# Altium project Seminar_SuperBC.PrjPcb
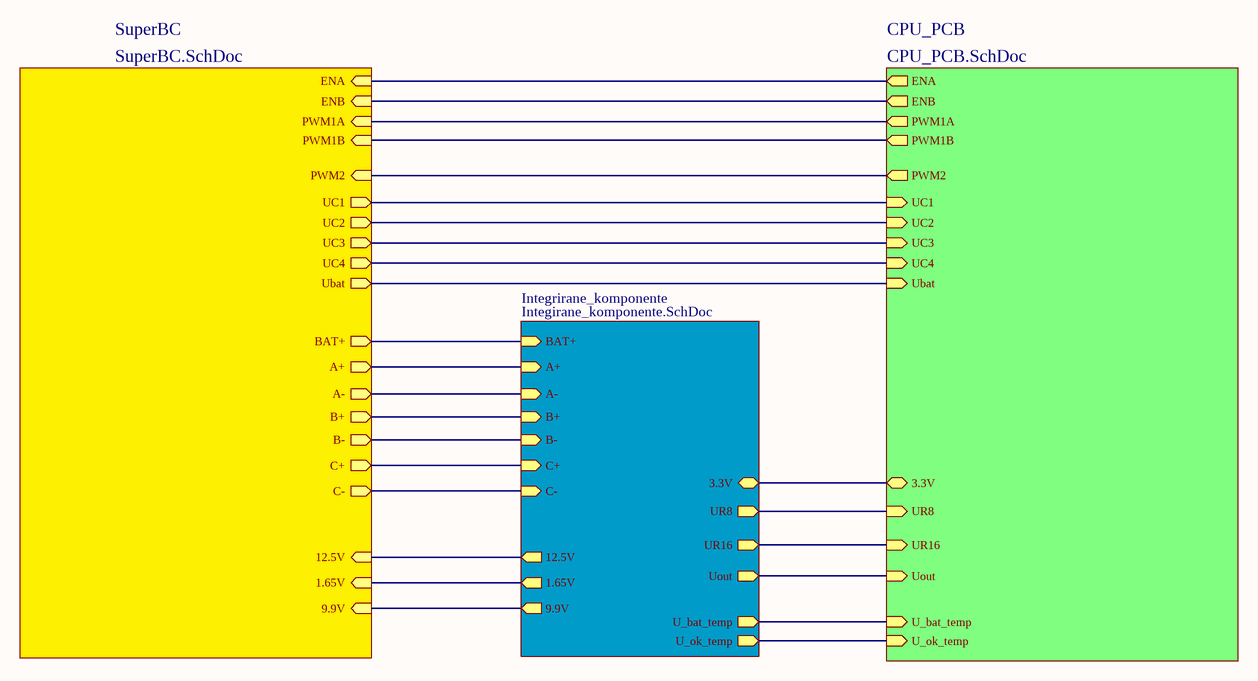
[diagram p0: Main.SchDoc]
4 sheets, 197 parts. Net scope: hierarchical (ports join the sheet entries above them; power ports are global).
Board file: PCB.PcbDoc
Sheets:
  Main.SchDoc
    CPU_PCB = CPU_PCB.SchDoc
    SuperBC = SuperBC.SchDoc
    Integrirane_komponente = Integirane_komponente.SchDoc

## Sheet Main.SchDoc
size A4; Address1: Unska 3; Address2: 10000; Address3: Zagreb; SheetNumber: 1; DocumentName: Main; ProjectName: Main

### Sub-sheets
CPU_PCB = CPU_PCB.SchDoc: PWM1A (out), PWM2 (out), UC1 (in), UC2 (in), UC3 (in), UC4 (in), Ubat (in), UR8 (in), UR16 (in), Uout (in), 3.3V, U_bat_temp (in), U_ok_temp (in), PWM1B (out), ENA (out), ENB (out)
Integrirane_komponente = Integirane_komponente.SchDoc: BAT+ (in), A+ (in), A- (in), B+ (in), B- (in), C+ (in), C- (in), 12.5V (out), 1.65V (out), 9.9V (out), UR8 (out), UR16 (out), Uout (out), 3.3V, U_bat_temp (out), U_ok_temp (out)
SuperBC = SuperBC.SchDoc: PWM1A (in), PWM2 (in), UC1 (out), UC2 (out), UC3 (out), UC4 (out), Ubat (out), BAT+ (out), A+ (out), A- (out), B+ (out), B- (out), C+ (out), C- (out), 12.5V (in), 1.65V (in), 9.9V (in), PWM1B (in), ENB (in), ENA (in)

### Nets
1.65V: sheet SuperBC/1.65V, sheet Integrirane_komponente/1.65V
3.3V: sheet CPU_PCB/3.3V, sheet Integrirane_komponente/3.3V
9.9V: sheet SuperBC/9.9V, sheet Integrirane_komponente/9.9V
12.5V: sheet SuperBC/12.5V, sheet Integrirane_komponente/12.5V
A-: sheet SuperBC/A-, sheet Integrirane_komponente/A-
B-: sheet SuperBC/B-, sheet SuperBC/C+, sheet Integrirane_komponente/B-, sheet Integrirane_komponente/C+
BAT+: sheet SuperBC/BAT+, sheet Integrirane_komponente/BAT+
UC4: sheet CPU_PCB/UC4, sheet SuperBC/UC4
A+: sheet SuperBC/A+, sheet Integrirane_komponente/A+
B+: sheet SuperBC/B+, sheet Integrirane_komponente/B+
C-: sheet SuperBC/C-, sheet Integrirane_komponente/C-
ENA: sheet CPU_PCB/ENA, sheet SuperBC/ENA
ENB: sheet CPU_PCB/ENB, sheet SuperBC/ENB
PWM1A: sheet CPU_PCB/PWM1A, sheet SuperBC/PWM1A
PWM1B: sheet CPU_PCB/PWM1B, sheet SuperBC/PWM1B
PWM2: sheet CPU_PCB/PWM2, sheet SuperBC/PWM2
U_bat_temp: sheet CPU_PCB/U_bat_temp, sheet Integrirane_komponente/U_bat_temp
U_ok_temp: sheet CPU_PCB/U_ok_temp, sheet Integrirane_komponente/U_ok_temp
Ubat: sheet CPU_PCB/Ubat, sheet SuperBC/Ubat
UC1: sheet CPU_PCB/UC1, sheet SuperBC/UC1
UC2: sheet CPU_PCB/UC2, sheet SuperBC/UC2
UC3: sheet CPU_PCB/UC3, sheet SuperBC/UC3
Uout: sheet CPU_PCB/Uout, sheet Integrirane_komponente/Uout
UR8: sheet CPU_PCB/UR8, sheet Integrirane_komponente/UR8
UR16: sheet CPU_PCB/UR16, sheet Integrirane_komponente/UR16

## Sheet CPU_PCB.SchDoc: CPU
size A4; Organization: FER; Address1: Unska 3; Address2: 10000 Zagreb; Address3: Croatia; SheetNumber: 3; SheetTotal: 4
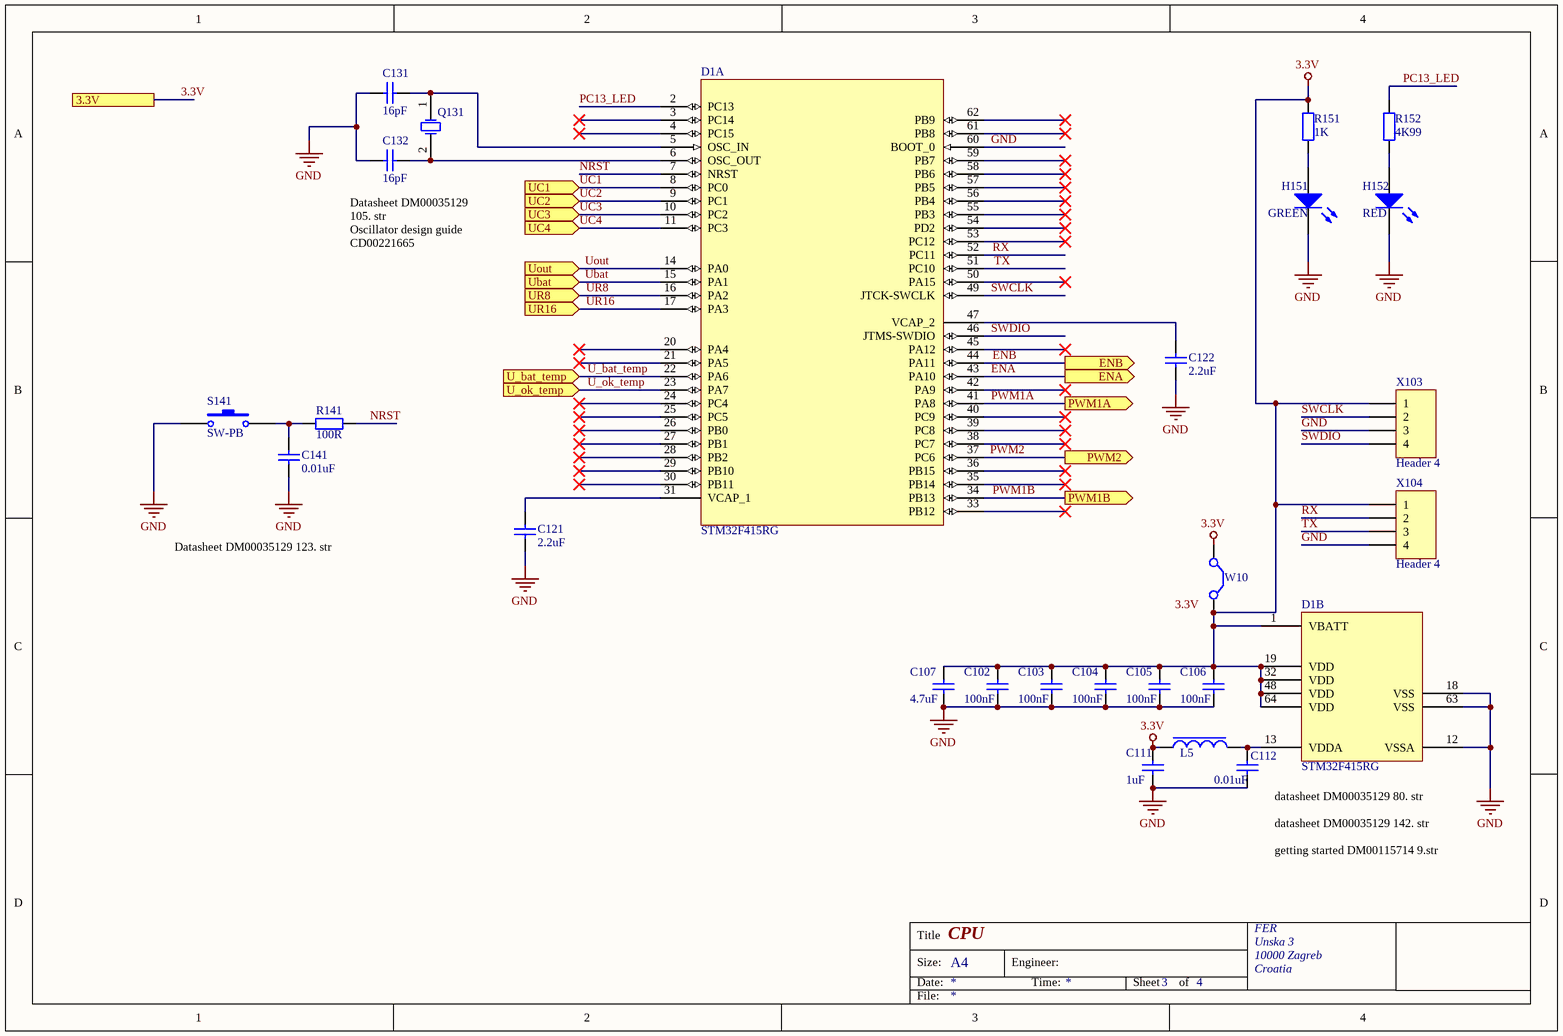
[diagram p1: CPU_PCB.SchDoc]

### Parts
C102  100nF  [CAP_0805]
C103  100nF  [CAP_0805]
C104  100nF  [CAP_0805]
C105  100nF  [CAP_0805]
C106  100nF  [CAP_0805]
C107  4.7uF  [CAP_0805]
C111  1uF  [CAP_0805]
C112  0.01uF  [CAP_0603]
C121  2.2uF  [CAP_0805]
C122  2.2uF  [CAP_0805]
C131  16pF  [CAP_0603]
C132  16pF  [CAP_0603]
C141  0.01uF  [CAP_0603]
D1  STM32F415RG  [LQFP64]  (parts A,B of 2)
H151  GREEN  [LED 1.25X2 SMD]
H152  RED  [LED 1.25X2 SMD]
L5  Inductor  [C0805]  (value not drawn)
Q131  XTAL  [QUARTZ_SMD_16MHZ]  (value not drawn)
R141  100R  [RES_0805]
R151  1K  [RES_0603]
R152  4K99  [RES_0805]
S141  SW-PB  [SWITCH KSEK43GLFS]
W10  Jumper  [HDR1X2]  (value not drawn)
X103  Header 4  [HEADER-4_PIN]
X104  Header 4  [HEADER-4_PIN]

### Ports
3.3V, ENA (out), ENB (out), PWM1A (out), PWM1B (out), PWM2 (out), U_bat_temp (in), U_ok_temp (in), Ubat (in), UC1 (in), UC2 (in), UC3 (in), UC4 (in), Uout (in), UR8 (in), UR16 (in)

### Nets
3.3V: C102.2 C103.2 C104.2 C105.2 C106.2 C107.2 C111.2 D1.1(VBATT) D1.19(VDD) D1.32(VDD) D1.48(VDD) D1.64(VDD) L5.1 R151.2 W10.1(C1) W10.2(C2) X103.1 X104.1 ; port 3.3V
GND: C102.1 C103.1 C104.1 C105.1 C106.1 C107.1 C111.1 C112.1 C121.1 C122.1 C131.2 C132.2 C141.1 D1.12(VSSA) D1.18(VSS) D1.60(BOOT_0) D1.63(VSS) H151.2(K) H152.2(K) S141.2 X103.3 X104.4  [project net A-]
UC4: D1.11(PC3) ; port UC4
ENA: D1.43(PA10) ; port ENA
ENB: D1.44(PA11) ; port ENB
NRST: D1.7(NRST) R141.1
PC13_LED: D1.2(PC13) R152.2
PWM1A: D1.41(PA8) ; port PWM1A
PWM1B: D1.34(PB13) ; port PWM1B
PWM2: D1.37(PC6) ; port PWM2
RX: D1.52(PC11) X104.2
SWCLK: D1.49(JTCK-SWCLK) X103.2
SWDIO: D1.46(JTMS-SWDIO) X103.4
TX: D1.51(PC10) X104.3
U_bat_temp: D1.22(PA6) ; port U_bat_temp
U_ok_temp: D1.23(PA7) ; port U_ok_temp
Ubat: D1.15(PA1) ; port Ubat
UC1: D1.8(PC0) ; port UC1
UC2: D1.9(PC1) ; port UC2
UC3: D1.10(PC2) ; port UC3
Uout: D1.14(PA0) ; port Uout
UR8: D1.16(PA2) ; port UR8
UR16: D1.17(PA3) ; port UR16
NetC112_2: C112.2 D1.13(VDDA) L5.2
NetC121_2: C121.2 D1.31(VCAP_1)
NetC122_2: C122.2 D1.47(VCAP_2)
NetC131_1: C131.1 D1.5(OSC_IN) Q131.1(OSC1)
NetC132_1: C132.1 D1.6(OSC_OUT) Q131.2(OSC2)
NetC141_2: C141.2 R141.2 S141.1
NetH151_1: H151.1(A) R151.1
NetH152_1: H152.1(A) R152.1

Not connected (* = marked no-connect by the designer): D1 3(PC14)* 4(PC15)* 20(PA4)* 21(PA5)* 24(PC4)* 25(PC5)* 26(PB0)* 27(PB1)* 28(PB2)* 29(PB10)* 30(PB11)* 33(PB12)* 35(PB14)* 36(PB15)* 38(PC7)* 39(PC8)* 40(PC9)* 42(PA9)* 45(PA12)* 50(PA15)* 53(PC12)* 54(PD2)* 55(PB3)* 56(PB4)* 57(PB5)* 58(PB6)* 59(PB7)* 61(PB8)* 62(PB9)*

### Notes on the sheet
- (near C132) Datasheet DM00035129 105. str
  Oscillator design guide CD00221665
- Datasheet DM00035129 123. str
- datasheet DM00035129 80. str
  datasheet DM00035129 142. str
  getting started DM00115714 9.str
- Labels drawn without touching a wire or pin: 3.3V
- Title
- Size:
- Date:
- A4
- Engineer:
- Time:
- Sheet
- of
- File:

### Library data of the parts
C102-C106 = Cap: Capacitor; cijena (funte): 0.182; dobavljač: Farnell; kataloški broj: 1856515; opis komponente: Capacitor 100nF ceramic; Value: 100nF
C107 = Cap: Capacitor; cijena (funte): 0.61; dobavljač: Farnell; kataloški broj: 2346932; opis komponente: Capacitor 4.7uF ceramic; Value: 4.7uF
C111 = Cap: Capacitor; cijena (funte): 0.0507; dobavljač: Farnell; kataloški broj: 2496946; opis komponente: Capacitor 1uF ceramic; Value: 1uF
C112 C141 = Cap: Capacitor; cijena (funte): 0.0529; dobavljač: Farnell; kataloški broj: 1709948; opis komponente: Capacitor 0.01uF ceramic; Value: 0.01uF
C121 C122 = Cap: Capacitor; cijena (funte): 0.186; dobavljač: Farnell; kataloški broj: 1845751; opis komponente: Capacitor 2.2uF ceramic; Value: 2.2uF
C131 C132 = Cap: Capacitor; cijena (funte): 0.239; dobavljač: Farnell; kataloški broj: 1885400; opis komponente: Capacitor 16pF; Value: 16pF
D1 = STM32F415RG: Processor; cijena (funte): 7.87; dobavljač: Farnell; kataloški broj: 2064370; opis komponente: STM32F415RG
H151 = LED0: Typical INFRARED GaAs LED; cijena (funte): 0.0613; dobavljač: Farnell; kataloški broj: 2463991; opis komponente: LED diode GREEN; Value: Green
H152 = LED0: Typical INFRARED GaAs LED; cijena (funte): 0.259; dobavljač: Farnell; kataloški broj: 2610416; opis komponente: LED diode red; Value: Red
L5 = Inductor: cijena (funte): 0.0859; dobavljač: Farnell; kataloški broj: 2329422; opis komponente: ferrite bead
Q131 = XTAL: Crystal Oscillator; Value: 16MHz; cijena (funte): 0.535; dobavljač: Farnell; kataloški broj: 1611806; opis komponente: oscilator
R141 = Res2: Resistor; cijena (funte): 0.01; dobavljač: Farnell; kataloški broj: 9333703; opis komponente: Resistor 100R; Value: 100R
R151 = Res2: Resistor; cijena (funte): 0.0444; dobavljač: Farnell; kataloški broj: 1469740; opis komponente: Resistor 1K, 1%; Value: 1K
R152 = Res2: Resistor; cijena (funte): 0.56; dobavljač: Farnell; kataloški broj: 2094815; opis komponente: Resistor 4K99, 0.1%; Value: 4K99
S141 = SW-PB: Switch; cijena (funte): 0.159; dobavljač: Farnell; kataloški broj: 2435308
W10 = Jumper: Jumper Wire; cijena (funte): 0.0874; dobavljač: Farnell; kataloški broj: 2396303; opis komponente: jumper
X103 X104 = Header 4: Header, 4-Pin; dobavljač: Farnell; kataloški broj: 1022264; opis komponente: konektor

## Sheet SuperBC.SchDoc: =GSGS
size A3; Engineer: aloha; Address1: Unska 3; Address2: 10000 Zagreb; Address3: Croatia; SheetNumber: 2; SheetTotal: 4; : 2
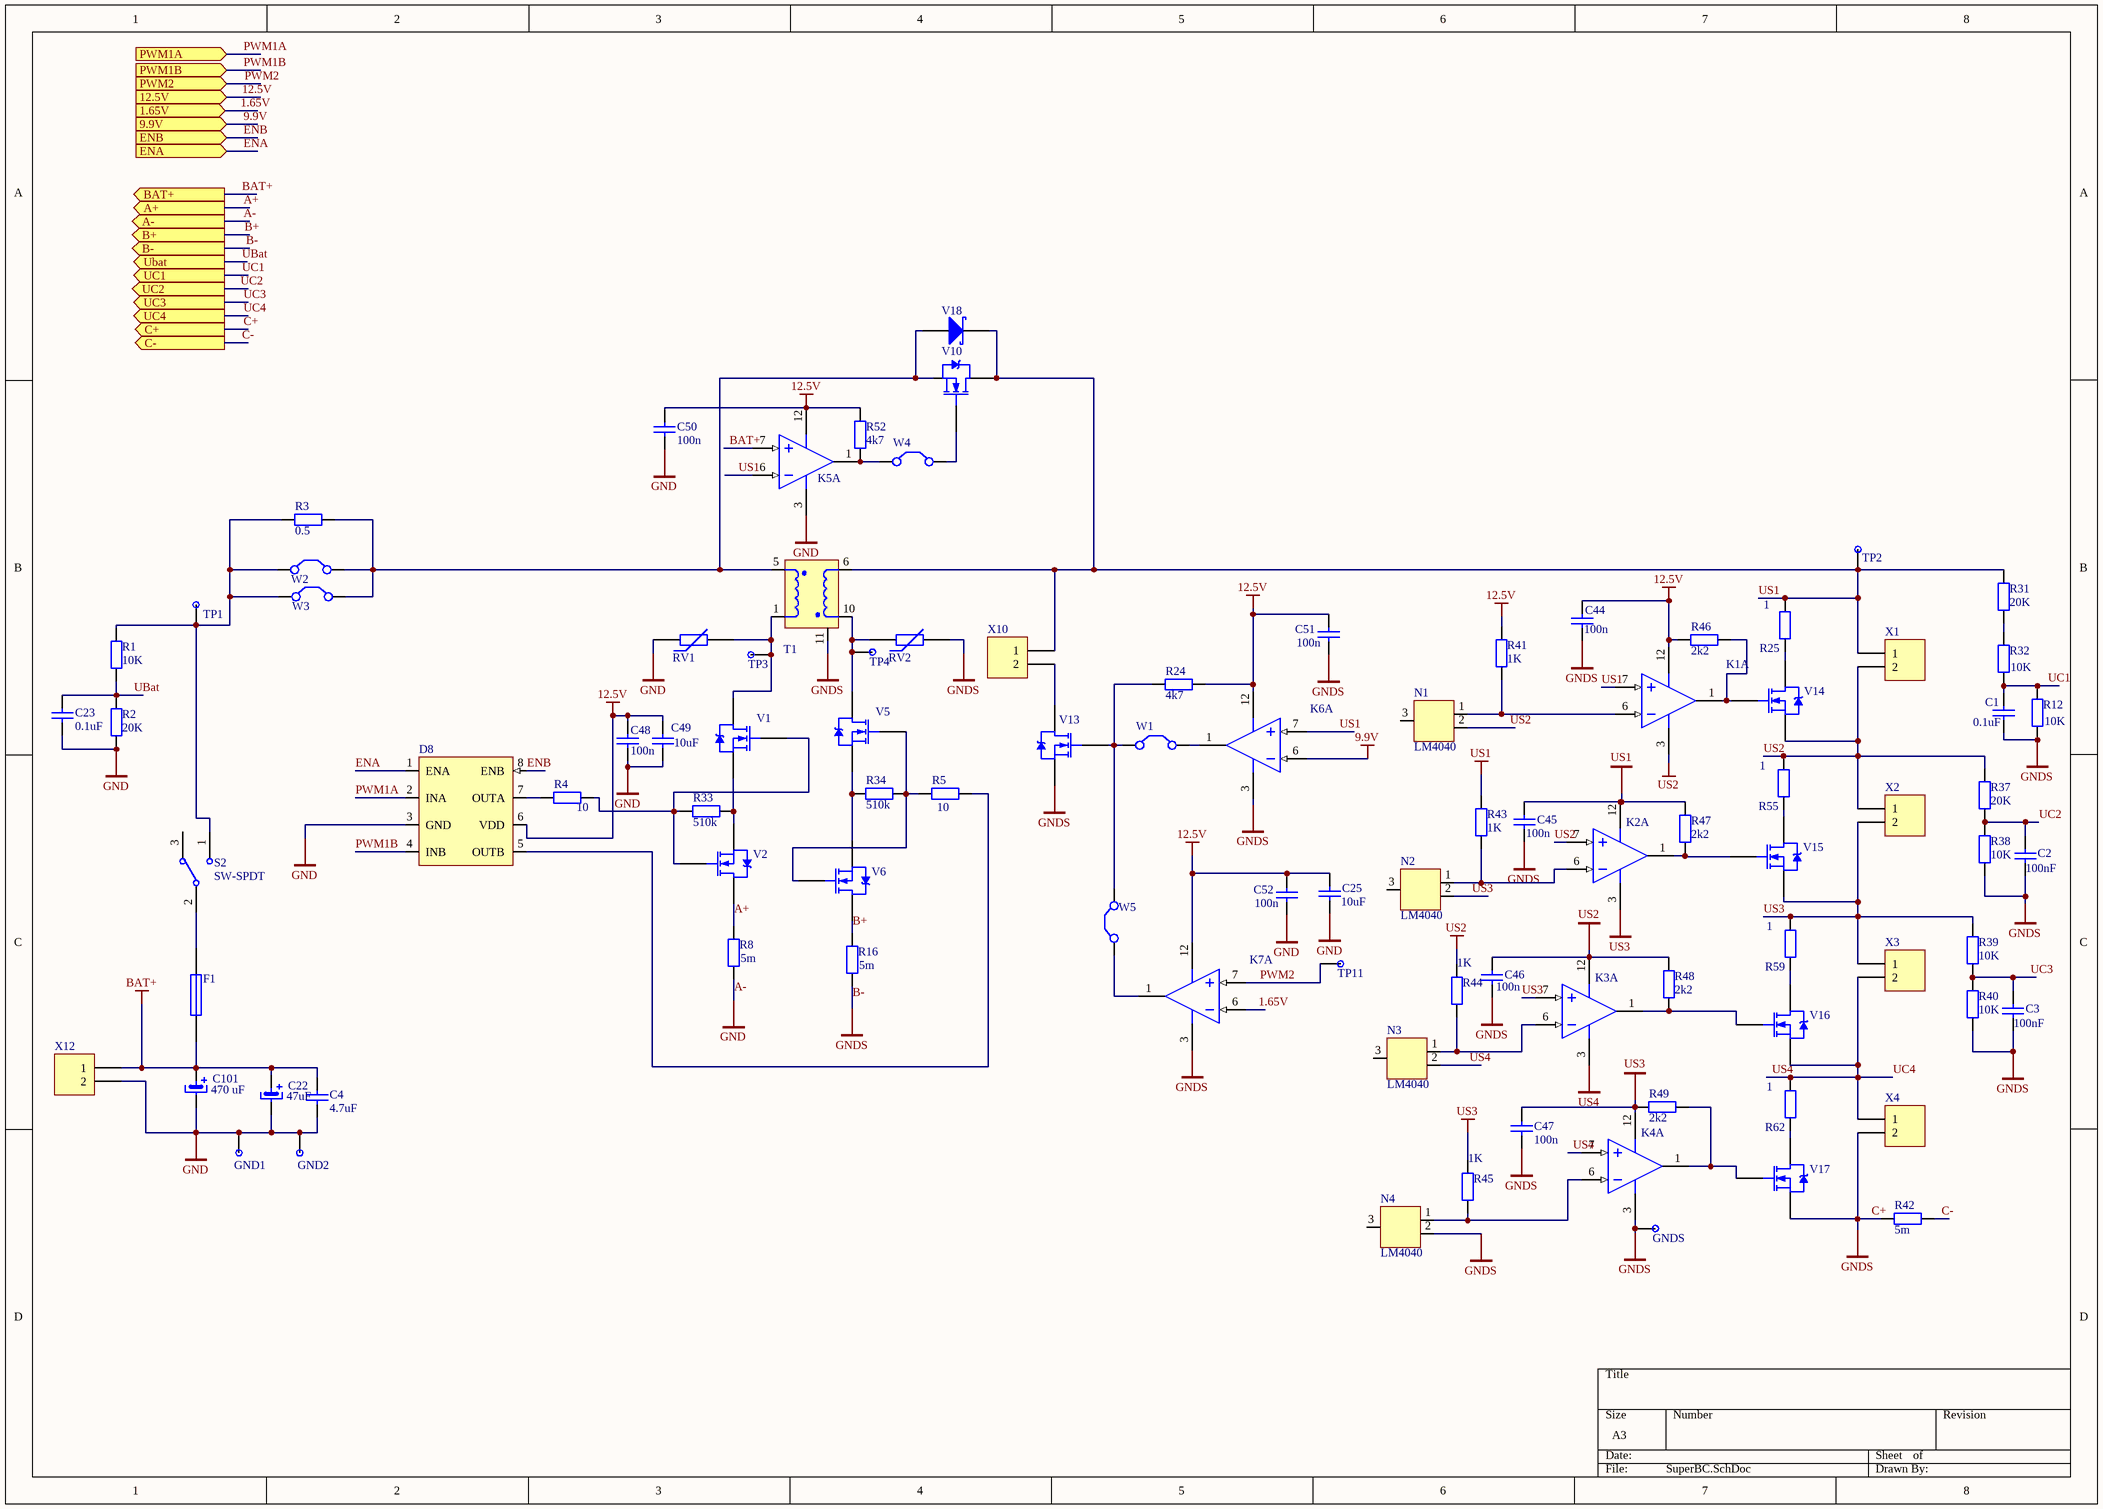
[diagram p2: SuperBC.SchDoc]

### Parts
C1  0.1uF  [C1210_L]
C2  value 100nF  [C1210_L]  (hidden comment: 0.1uF)
C3  value 100nF  [C1210_L]  (hidden comment: 0.1uF)
C4  4.7uF  [C0805]
C22  47uF  [SMD_CAP_RAD_8X10.2]
C23  0.1uF  [C1210_L]
C25  10uF  [C1210_L]
C44  100n  [C0805]
C45  100n  [C0805]
C46  100n  [C0805]
C47  100n  [C0805]
C48  100n  [C0805]
C49  10uF  [C1210_L]
C50  100n  [C0805]
C51  100n  [C0805]
C52  100n  [C0805]
C101  470 uF  [SMD_CAP_RAD_8X10.2]
D8  driver_mosfet  [SOIC8]  (value not drawn)
F1  Fuse 1  [C1206]  (value not drawn)
GND1  *  (value not drawn)
GND2  *  (value not drawn)
GNDS  *  (value not drawn)
K1  TLC3704QJ  [SOT-23]  (value not drawn)  (part A of 4)
K2  TLC3704QJ  [SOT-23]  (value not drawn)  (part A of 4)
K3  TLC3704QJ  [SOT-23]  (value not drawn)  (part A of 4)
K4  TLC3704QJ  [SOT-23]  (value not drawn)  (part A of 4)
K5  NCS2200  [SOT-23]  (value not drawn)  (part A of 4)
K6  TLC3704QJ  [SOT-23]  (value not drawn)  (part A of 4)
K7  TLC3704QJ  [SOT-23]  (value not drawn)  (part A of 4)
N1  LM4040  [SOT-23-ref_chip]
N2  LM4040  [SOT-23-ref_chip]
N3  LM4040  [SOT-23-ref_chip]
N4  LM4040  [SOT-23-ref_chip]
R1  10K  [C1210_L]
R2  20K  [C1210_L]
R3  0.5  [C2512]
R4  10  [C0805]
R5  10  [C0805]
R8  5m  [otpornik R8, R16]
R12  10K  [C1210_L]
R16  5m  [otpornik R8, R16]
R24  4k7  [C1206]
R25  1  [F za 7W otpornik]
R31  20K  [C1210_L]
R32  10K  [C1210_L]
R33  510k  [C1210_L]
R34  510k  [C1210_L]
R37  20K  [C1210_L]
R38  10K  [C1210_L]
R39  10K  [C1210_L]
R40  10K  [C1210_L]
R41  1K  [C1210_L]
R42  5m  [otpornik R8, R16]
R43  1K  [C1210_L]
R44  1K  [C1210_L]
R45  1K  [C1210_L]
R46  2k2  [C1210_L]
R47  2k2  [C1210_L]
R48  2k2  [C1210_L]
R49  2k2  [C1210_L]
R52  4k7  [C1206]
R55  1  [F za 7W otpornik]
R59  1  [F za 7W otpornik]
R62  1  [F za 7W otpornik]
RV1  Res Varistor  [C1210_L]  (value not drawn)
RV2  Res Varistor  [C1210_L]  (value not drawn)
S2  SW-SPDT  [toggle_switch]
T1  transformator  [F za transformator]  (value not drawn)
TP1  *  (value not drawn)
TP2  *  (value not drawn)
TP3  *  (value not drawn)
TP4  *  (value not drawn)
TP11  *  (value not drawn)
V1  NMOS-2  [SO-8L single_f]  (value not drawn)
V2  NMOS-2  [SO-8L single_f]  (value not drawn)
V5  NMOS-2  [SO-8L single_f]  (value not drawn)
V6  NMOS-2  [SO-8L single_f]  (value not drawn)
V10  MOSFET-N  [TO-252-3]  (value not drawn)
V13  MOSFET-N  [TO-252-3]  (value not drawn)
V14  NMOS-2  [SO-8L single_f]  (value not drawn)
V15  NMOS-2  [SO-8L single_f]  (value not drawn)
V16  NMOS-2  [SO-8L single_f]  (value not drawn)
V17  NMOS-2  [SO-8L single_f]  (value not drawn)
V18  Schottky Diode  [TO-220-AB]  (value not drawn)
W1  Jumper  [HDR1X2]  (value not drawn)
W2  Jumper 4.3A  [HDR1X2]  (value not drawn)
W3  Jumper 4.3A  [HDR1X2]  (value not drawn)
W4  Jumper  [HDR1X2]  (value not drawn)
W5  Jumper  [HDR1X2]  (value not drawn)
X1  Header 2  [F Header 1x2]  (value not drawn)
X2  Header 2  [F Header 1x2]  (value not drawn)
X3  Header 2  [F Header 1x2]  (value not drawn)
X4  Header 2  [F Header 1x2]  (value not drawn)
X10  Header 2  [F Header 1x2]  (value not drawn)
X12  Header 2  [F Header 1x2]  (value not drawn)

### Ports
1.65V (in), 9.9V (in), 12.5V (in), A+ (out), A- (out), B+ (out), B- (out), BAT+ (out), C+ (out), C- (out), ENA (in), ENB (in), PWM1A (in), PWM1B (in), PWM2 (in), Ubat (out), UC1 (out), UC2 (out), UC3 (out), UC4 (out)

### Nets
1.65V: K7.6(IN-) ; port 1.65V
9.9V: K6.6(IN-) ; port 9.9V
12.5V: C25.2 C44.2 C48.2 C49.2 C50.2 C51.2 C52.2 D8.6(VDD) K1.12(V-) K5.12(V-) K6.12(V-) K7.12(V-) R24.2 R41.2 R46.1 R52.2 ; port 12.5V
A-: C4.1 C22.2 C23.1 C25.1 C48.1 C49.1 C50.1 C52.1 C101.2 D8.3(GND) GND1.1 GND2.1 K5.3(V+) R2.1 R8.1 RV1.1 X12.2 ; port A-  [also labelled GND]
B-: C1.1 C2.1 C3.1 C44.1 C45.1 C46.1 C47.1 C51.1 GNDS.1 K4.3(V+) K6.3(V+) K7.3(V+) N4.2 R12.1 R16.1 R38.1 R40.1 R42.2 RV2.2 T1.11 V13.2(S) V17.3(S) X4.2 ; port B-, port C+  [also labelled C+, GNDS]
BAT+: C4.2 C22.1 C101.1 F1.1 K5.7(IN+) X12.1 ; port BAT+
UC4: K3.3(V+) K4.7(IN+) N3.2 R62.2 V16.3(S) X3.2 X4.1 ; port UC4  [also labelled US4]
US1: C45.2 K1.7(IN+) K2.12(V-) K5.6(IN-) K6.7(IN+) R25.2 R31.2 R43.2 R47.2 T1.6 TP2.1 V10.3(D) V18.1(A) X1.1 X10.1
US2: C46.2 K1.3(V+) K2.7(IN+) K3.12(V-) N1.2 R37.2 R44.2 R48.2 R55.2 V14.3(S) X1.2 X2.1
US3: C47.2 K2.3(V+) K3.7(IN+) K4.12(V-) N2.2 R39.2 R45.2 R49.2 R59.2 V15.3(S) X2.2 X3.1
A+: R8.2 V2.2(D) ; port A+
B+: R16.2 V6.2(D) ; port B+
C-: R42.1 ; port C-
ENA: D8.1(ENA) ; port ENA
ENB: D8.8(ENB) ; port ENB
PWM1A: D8.2(INA) ; port PWM1A
PWM1B: D8.4(INB) ; port PWM1B
PWM2: K7.7(IN+) TP11.1 ; port PWM2
Ubat: C23.2 R1.1 R2.2 ; port Ubat
UC1: C1.2 R12.2 R32.1 ; port UC1
UC2: C2.2 R37.1 R38.2 ; port UC2
UC3: C3.2 R39.1 R40.2 ; port UC3
NetD8_5: D8.5(OUTB) R5.2
NetD8_7: D8.7(OUTA) R4.1
NetF1_2: F1.2 S2.2
NetK1_1: K1.1(OUT) R46.2 V14.1(G)
NetK1_6: K1.6(IN-) N1.1 R41.1
NetK2_1: K2.1(OUT) R47.1 V15.1(G)
NetK2_6: K2.6(IN-) N2.1 R43.1
NetK3_1: K3.1(OUT) R48.1 V16.1(G)
NetK3_6: K3.6(IN-) N3.1 R44.1
NetK4_1: K4.1(OUT) R49.1 V17.1(G)
NetK4_6: K4.6(IN-) N4.1 R45.1
NetK5_1: K5.1(OUT) R52.1 W4.1(C1)
NetK6_1: K6.1(OUT) W1.2(C2)
NetK7_1: K7.1(OUT) W5.1(C1)
NetR1_2: R1.2 R3.1 S2.1 TP1.1 W2.1(C1) W3.1(C1)
NetR3_2: R3.2 T1.5 V10.2(S) V18.2(K) W2.2(C2) W3.2(C2)
NetR4_2: R4.2 R33.1 V1.1(G) V2.1(G)
NetR5_1: R5.1 R34.2 V5.1(G) V6.1(G)
NetR24_1: R24.1 V13.1(G) W1.1(C1) W5.2(C2)
NetR25_1: R25.1 V14.2(D)
NetR31_1: R31.1 R32.2
NetR33_2: R33.2 V1.3(S) V2.3(S)
NetR34_1: R34.1 V5.3(S) V6.3(S)
NetR55_1: R55.1 V15.2(D)
NetR59_1: R59.1 V16.2(D)
NetR62_1: R62.1 V17.2(D)
NetRV1_2: RV1.2 T1.1 TP3.1 V1.2(D)
NetRV2_1: RV2.1 T1.10 TP4.1 V5.2(D)
NetV10_1: V10.1(G) W4.2(C2)
NetV13_3: V13.3(D) X10.2

Not connected (* = marked no-connect by the designer): N1 3; N2 3; N3 3; N4 3; S2 3

### Library data of the parts
C1 C23 = Cap: Capacitor; Value: 100nF; dobavljač: Farnell; kataloški broj: 1828960; cijena (funte): 0.241; opis komponente: Capacitor
C2 C3 = Cap: Capacitor; cijena (funte): 0.241; dobavljač: Farnell; kataloški broj: 1828960; opis komponente: Capacitor
C4 = Cap: Capacitor; dobavljač: Farnell; kataloški broj: 2346932; cijena (funte): 0.61; opis komponente: Capacitor 4.7uF ceramic; Value: 4.7uF
C22 = elko: dobavljač: Farnell; kataloški broj: 9696032; cijena (funte): 0.619; opis komponente: Electrolytic Capacitor; Value: 47uF
C25 = Cap: Capacitor; dobavljač: Farnell; kataloški broj: 2320931; opis komponente: Capacitor 100nF; Value: 10uF; cijena (funte): -
C44-C48 C50-C52 = Cap: Capacitor; Value: 100nF; cijena (funte): 0.141; dobavljač: Farnell; kataloški broj: 1856515; opis komponente: Capacitor 100nF
C49 = Cap: Capacitor; dobavljač: Farnell; kataloški broj: 2320931; Value: 10 uF; cijena (funte): -; opis komponente: Capacitor
C101 = elko: dobavljač: Farnell; kataloški broj: 1539457; cijena (funte): 0.794; opis komponente: Electrolytic Capacitor 470 µF; Value: 470 uF
D8 = driver_mosfet: cijena (funte): 1.43; dobavljač: Farnell; kataloški broj: 2782690; opis komponente: driver_mosfet
F1 = Fuse 1: Fuse; cijena (funte): 0.228; dobavljač: Farnell; kataloški broj: 2834845; opis komponente: osigurač 8A
GND1 GND2 GNDS TP1-TP4 TP11 = testpoint
K1-K7 = LP2901D: Low Power Quad Differential Comparator; cijena (funte): 0.239; dobavljač: Farnell; kataloški broj: 2510412; opis komponente: Analogue Comparator
N1-N4 = referentni chip: cijena (funte): 0.567; dobavljač: Farnell; kataloški broj: 9778322; opis komponente: chip za ref napon; Value: 2.5V
R1 R12 R32 = Res2: Resistor; dobavljač: Farnell; kataloški broj: 2502771; cijena (funte): 0.304; opis komponente: Resistor 10K
  R1 R12: Value: 10K
  R32: Value: 10k
R2 R31 = Res2: Resistor; dobavljač: Farnell; kataloški broj: 2380713; cijena (funte): 0.249; opis komponente: Resistor 20K; Value: 20K
R3 = Res2: Resistor; dobavljač: Farnell; kataloški broj: 1100070; cijena (funte): 0.60; Value: 0.5; opis komponente: Resistor
R4 R5 = Res2: Resistor; cijena (funte): 0.0786; dobavljač: Farnell; kataloški broj: 2380457; opis komponente: resitor 10 ohm; Value: 10
R8 R16 R42 = Res2: Resistor; dobavljač: Farnell; kataloški broj: 2363991; cijena (funte): 2.49; Value: 5m; opis komponente: Resistor
R24 R52 = Res2: Resistor; cijena (funte): 0.0274; dobavljač: Farnell; kataloški broj: 1100209; Value: 4k7; opis komponente: resistor
R25 R55 R59 R62 = Res2: Resistor; dobavljač: Farnell; kataloški broj: 1292518; cijena (funte): 0.426; opis komponente: Through Hole Resistor 7W; Value: 1
R33 R34 = Res2: Resistor; cijena (funte): 0.26; dobavljač: Farnell; kataloški broj: 1894354; Value: 510 k; opis komponente: resistor
R37 = Res2: Resistor; cijena (funte): 0.249; dobavljač: Farnell; kataloški broj: 2380713; opis komponente: Resistor 20K; Value: 20K
R38-R40 = Res2: Resistor; cijena (funte): 0.304; dobavljač: Farnell; kataloški broj: 2502771; opis komponente: Resistor 10K; Value: 10K
R41 R43-R45 = Res2: Resistor; cijena (funte): 0.0952; dobavljač: Farnell; kataloški broj: 2324006; Value: 1K; opis komponente: resistor
R46-R49 = Res2: Resistor; cijena (funte): 0.0949; dobavljač: Farnell; kataloški broj: 2324037; Value: 2k2; opis komponente: resistor
RV1 = Res Varistor: Varistor (Voltage-Sensitive Resistor); cijena (funte): 0.40; dobavljač: Farnell; kataloški broj: 2717744; opis komponente: Varistor (90V); Value: Varistor (90V)
RV2 = Res Varistor: Varistor (Voltage-Sensitive Resistor); cijena (funte): 0.40; dobavljač: Farnell; kataloški broj: 2717744; opis komponente: Varistor (90V); Value: MLV
S2 = SW-SPDT: SPDT Subminiature Toggle Switch, Right Angle Mounting, Vertical Actuation; cijena (funte): 2; dobavljač: Farnell; kataloški broj: 2292959; opis komponente: sklopka 5A
V1 V2 V5 V6 V14-V17 = NMOS-2: N-Channel Power MOSFET; dobavljač: Farnell; opis komponente: N-MOSFET
V10 V13 = NMOS-2: N-Channel Power MOSFET; cijena (funte): 0.585; dobavljač: Farnell; kataloški broj: 1794799; opis komponente: N-MOSFET
V18 = D Schottky: cijena (funte): 0.26; dobavljač: Farnell; kataloški broj: 2675118; opis komponente: Schottky Diode
W1 W4 W5 = Jumper: as W10 on sheet CPU_PCB; opis komponente: jumper
W2 W3 = Jumper: Jumper Wire; cijena (funte): 0.149; dobavljač: Farnell; kataloški broj: 2505007; opis komponente: jumper 4.3A
X1-X4 X10 X12 = Header 2: Header, 2-Pin; cijena (funte): 0.239; dobavljač: Farnell; kataloški broj: 2396251; opis komponente: Header, 2-Pin

## Sheet Integirane_komponente.SchDoc
size A4
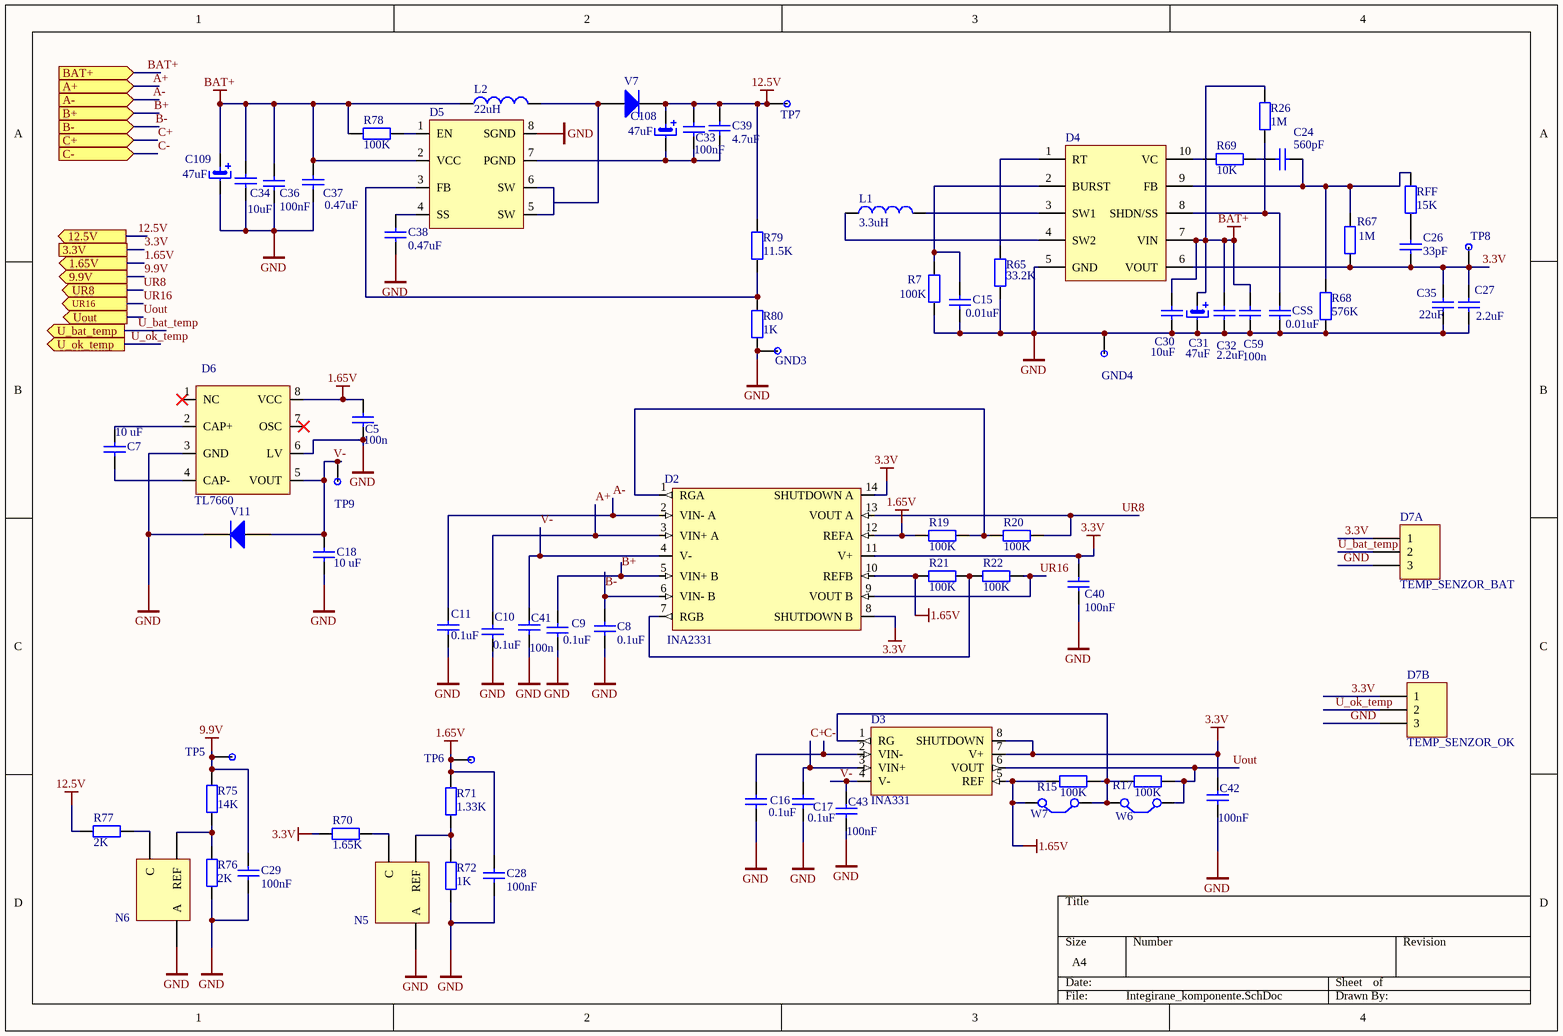
[diagram p3: Integirane_komponente.SchDoc]

### Parts
C5  100n  [C0805]
C7  10 uF  [C1210_L]
C8  0.1uF  [C1210_L]
C9  0.1uF  [C1210_L]
C10  0.1uF  [C1210_L]
C11  0.1uF  [C1210_L]
C15  0.01uF  [CAP_0603]
C16  0.1uF  [C1210_L]
C17  0.1uF  [C1210_L]
C18  10 uF  [C1210_L]
C24  560pF  [C0805]
C26  33pF  [0402]
C27  2.2uF  [C1210_L]
C28  100nF  [C0805]
C29  100nF  [C0805]
C30  10uF  [C1210_L]
C31  47uF  [SMD_CAP_RAD_8X10.2]
C32  2.2uF  [C1210_L]
C33  100nF  [C0805]
C34  10uF  [C1210_L]
C35  22uF  [C0805]
C36  100nF  [C0805]
C37  0.47uF  [C1210_L]
C38  0.47uF  [C1210_L]
C39  4.7uF  [C0805]
C40  100nF  [C0805]
C41  100n  [C0805]
C42  100nF  [C0805]
C43  100nF  [C0805]
C59  100n  [C0805]
C108  47uF  [SMD_CAP_RAD_8X10.2]
C109  47uF  [SMD_CAP_RAD_8X10.2]
CSS  0.01uF  [CAP_0603]
D2  INA2331  [F za pojacalo(2)]
D3  INA331  [F za pojačalo (1)]
D4  LTC3530EMS#PBF  [MSOP10]  (value not drawn)
D5  APE1911-HF-3  [ESOP8_12.5V]  (value not drawn)
D6  TL7660  [invertor]
D7A  TEMP_SENZOR_BAT  [temp_senzor]
D7B  TEMP_SENZOR_OK  [temp_senzor_datasheet]
GND3  *  (value not drawn)
GND4  *  (value not drawn)
L1  3.3uH  [inductor_3.3uH]
L2  22uH  [inductor_22uH]
N5  *  [SOT23_N5_N6]  (value not drawn)
N6  Voltage Reference  [SOT23_N5_N6]  (value not drawn)
R7  100K  [C0805]
R15  100K  [C0805]
R17  100K  [C0805]
R19  100K  [C0805]
R20  100K  [C0805]
R21  100K  [C0805]
R22  100K  [C0805]
R26  1M  [C1210_L]
R65  33.2K  [C1206]
R67  1M  [C1210_L]
R68  576K  [C1206]
R69  10K  [C0805]
R70  1.65K  [C0805]
R71  1.33K  [C0805]
R72  1K  [C1206]
R75  14K  [C1206]
R76  2K  [C1206]
R77  2K  [C1206]
R78  100K  [C0805]
R79  11.5K  [C0805]
R80  1K  [C1206]
RFF  15K  [C1206]
TP5  *  (value not drawn)
TP6  *  (value not drawn)
TP7  *  (value not drawn)
TP8  *  (value not drawn)
TP9  *  (value not drawn)
V7  B340A-13-F  [DO-214AC]  (value not drawn)
V11  Diode  [Diode -small signal]  (value not drawn)
W6  Jumper  [HDR1X2]  (value not drawn)
W7  Jumper  [HDR1X2]  (value not drawn)

### Ports
1.65V (out), 3.3V, 9.9V (out), 12.5V (out), A+ (in), A- (in), B+ (in), B- (in), BAT+ (in), C+ (in), C- (in), U_bat_temp (out), U_ok_temp (out), Uout (out), UR8 (out), UR16 (out)

### Nets
1.65V: C5.2 C28.1 D2.10(REFB) D2.12(REFA) D3.5(REF) D6.8(VCC) R15.2 R19.2 R21.2 R71.2 TP6.1 W7.2(C2) ; port 1.65V
3.3V: C26.2 C27.1 C35.1 C40.2 C42.2 D2.8(SHUTDOWN_B) D2.11(V+) D2.14(SHUTDOWN_A) D3.7(V+) D3.8(SHUTDOWN) D4.6(VOUT) D7A.1 D7B.1 R67.2 R70.1 TP8.1 ; port 3.3V
9.9V: C29.1 R75.2 TP5.1 ; port 9.9V
12.5V: C33.2 C39.2 C108.1 R77.2 R79.2 TP7.1 V7.2(K) ; port 12.5V
A-: C5.1 C8.1 C9.1 C10.1 C11.1 C11.2 C15.1 C16.1 C17.1 C18.1 C27.2 C28.2 C29.2 C30.1 C31.2 C32.2 C34.1 C35.2 C36.1 C37.1 C38.1 C40.1 C41.1 C42.1 C43.1 C59.1 C109.2 CSS.1 D2.2(VIN-_A) D4.5(GND) D5.8(SGND) D6.3(GND) D6.6(LV) D7A.3 D7B.3 GND3.1 GND4.1 N5.3(A) N6.3(A) R7.1 R65.1 R68.2 R72.1 R76.1 R80.1 V11.2(K) ; port A-  [also labelled GND]
B-: C8.2 C17.2 D2.6(VIN-_B) D3.3(VIN+) ; port B-, port C+  [also labelled C+]
BAT+: C30.2 C31.1 C32.1 C34.2 C36.2 C37.2 C59.2 C109.1 D4.7(VIN) D5.2(VCC) L2.1 R26.1 R78.1 ; port BAT+
A+: C10.2 D2.3(VIN+_A) ; port A+
B+: C9.2 D2.5(VIN+_B) ; port B+
C-: C16.2 D3.2(VIN-) ; port C-
U_bat_temp: D7A.2 ; port U_bat_temp
U_ok_temp: D7B.2 ; port U_ok_temp
Uout: D3.6(VOUT) R17.1 W6.1(C1) ; port Uout
UR8: D2.13(VOUT_A) R20.1 ; port UR8
UR16: D2.9(VOUT_B) R22.1 ; port UR16
V-: C18.2 C41.2 C43.2 D2.4(V-) D3.4(V-) D6.5(VOUT) TP9.1 V11.1(A)
NetC7_1: C7.1 D6.4(CAP-)
NetC7_2: C7.2 D6.2(CAP+)
NetC15_2: C15.2 D4.2(BURST) R7.2
NetC24_1: C24.1 D4.9(FB) R67.1 R68.1 RFF.2
NetC24_2: C24.2 R69.1
NetC26_1: C26.1 RFF.1
NetC33_1: C33.1 C39.1 C108.2 D5.7(PGND)
NetC38_2: C38.2 D5.4(SS)
NetCSS_2: CSS.2 D4.8(SHDN/SS) R26.2
NetD2_1: D2.1(RGA) R19.1 R20.2
NetD2_7: D2.7(RGB) R21.1 R22.2
NetD3_1: D3.1(RG) R15.1 R17.2 W6.2(C2) W7.1(C1)
NetD4_1: D4.1(RT) R65.2
NetD4_3: D4.3(SW1) L1.2
NetD4_4: D4.4(SW2) L1.1
NetD4_10: D4.10(VC) R69.2
NetD5_1: D5.1(EN) R78.2
NetD5_3: D5.3(FB) R79.1 R80.2
NetD5_5: D5.5(SW) D5.6(SW)
NetL2_2: L2.2 V7.1(A)
NetN5_1: N5.1(REF) R71.1 R72.2
NetN5_2: N5.2(C) R70.2
NetN6_1: N6.1(REF) R75.1 R76.2
NetN6_2: N6.2(C) R77.1

Not connected (* = marked no-connect by the designer): D6 1(NC)* 7(OSC)*

### Library data of the parts
C5 C41 C59 = Cap: as C44 on sheet SuperBC
C7 C18 = Cap: Capacitor; dobavljač: Farnell; kataloški broj: 2320934; cijena (funte): 0.275; opis komponente: Ceramic Capacitor; Value: 10 uF
C8-C11 C16 C17 = Cap: as C1 on sheet SuperBC; opis komponente: Capacitor
C15 CSS = Cap: Capacitor; cijena (funte): 0.0529; dobavljač: Farnell; kataloški broj: 1709948; opis komponente: Capacitor 0.01uF; Value: 0.01uF
C24 = Cap: Capacitor; cijena (funte): 0.127; dobavljač: Farnell; kataloški broj: 2332776; opis komponente: Capacitor 560pF; Value: 560pF
C26 = Cap: Capacitor; cijena (funte): 0.0496; dobavljač: Farnell; kataloški broj: 2821128; opis komponente: Capacitor 33pF; Value: 33pF
C27 = Cap: Capacitor; Value: 100pF; cijena (funte): 0.539; dobavljač: Farnell; kataloški broj: 2688549; opis komponente: ceramic capacitor
C28 C29 C33 C36 C40 C42 C43 = Cap: Capacitor; cijena (funte): 0.141; dobavljač: Farnell; kataloški broj: 1856515; opis komponente: Capacitor 100nF; Value: 100nF
C30 = Cap: as C49 on sheet SuperBC; Value: 10 uF; cijena (funte): -; opis komponente: Capacitor
C31 C108 C109 = elko: cijena (funte): 0.619; dobavljač: Farnell; kataloški broj: 9696032; opis komponente: Electrolytic Capacitor; Value: 47uF
C32 = Cap: Capacitor; Value: 100pF; cijena (funte): 0.539; dobavljač: Farnell; kataloški broj: 2688549; opis komponente: Ceramic Capacitor
C34 = Cap: as C25 on sheet SuperBC; Value: 10uF; cijena (funte): -
C35 = Cap: Capacitor; cijena (funte): 0.31; dobavljač: Farnell; kataloški broj: 2672185; opis komponente: Ceramic Capacitor; Value: 22uF
C37 C38 = Cap: Capacitor; cijena (funte): 0.302; dobavljač: Farnell; kataloški broj: 2320942; opis komponente: Capacitor 0.47uF; Value: 0.47uF
C39 = Cap: Capacitor; cijena (funte): 0.61; dobavljač: Farnell; kataloški broj: 2346932; opis komponente: Capacitor 4.7uF; Value: 4.7uF
D2 = pojačalo(2): cijena (funte): 2.95; dobavljač: Farnell; kataloški broj: 2496201; opis komponente: pojačalo
D3 = pojačalo (1): cijena (funte): 2.63; dobavljač: Farnell; kataloški broj: 1459472; opis komponente: INA331
D4 = LTC3530EMS#PBF: cijena (funte): 4.41; dobavljač: Farnell; kataloški broj: 1329368; opis komponente: LTC3530EMS#PBF
D5 = APE1911-HF-3: cijena (funte): 0.371; dobavljač: Farnell; kataloški broj: 2319645; opis komponente: Boost(Step Up) Regulator 12.5V
D6 = invertor: cijena (funte): 1.32; dobavljač: Farnell; kataloški broj: 1755282; opis komponente: invertor
D7A D7B = Header 3: Header, 3-Pin; cijena (funte): 0.516; dobavljač: Farnell; kataloški broj: 2432144; opis komponente: temp_senzor
GND3 GND4 TP5-TP9 = testpoint
L1 = Inductor: cijena (funte): 0.295; dobavljač: Farnell; kataloški broj: 2808289; opis komponente: zavojnica 3.3uH; Value: 3.3uH
L2 = Inductor: cijena (funte): 0.412; dobavljač: Farnell; kataloški broj: 2061654; opis komponente: Inductor 22uH; Value: 22uH
N5 = voltage_ref: cijena (funte): 0.299; dobavljač: Farnell; kataloški broj: 1904053; opis komponente: Voltage Reference 1.65V; Value: 1.65V
N6 = voltage_ref: cijena (funte): 0.299; dobavljač: Farnell; kataloški broj: 1904053; opis komponente: Voltage Reference 9.9V; Value: 9.9V
R7 R15 R17 R19-R22 R78 = Res2: Resistor; cijena (funte): 0.006; dobavljač: Farnell; kataloški broj: 2447551; opis komponente: Resistor 100K; Value: 100K
R26 = Res2: Resistor; cijena (funte): 0.206; dobavljač: Farnell; kataloški broj: 1153399; opis komponente: Resistor 1M; Value: 1M
R65 = Res2: Resistor; cijena (funte): 0.0253; dobavljač: Farnell; kataloški broj: 1632568; opis komponente: resistor 33.2K; Value: 33.2K
R67 = Res2: Resistor; cijena (funte): 0.206; dobavljač: FArnell; kataloški broj: 1153399; opis komponente: Resistor 1M; Value: 1M
R68 = Res2: Resistor; cijena (funte): 0.0292; dobavljač: Farnell; kataloški broj: 2307780; opis komponente: otpornik; Value: 576K
R69 = Res2: Resistor; cijena (funte): 0.237; dobavljač: Farnell; kataloški broj: 1577673; opis komponente: Resistor 10K; Value: 10K
R70 = Res2: Resistor; dobavljač: Farnell; kataloški broj: 1160148; cijena (funte): 0.48; opis komponente: Resistor 1.65K; Value: 1.65K
R71 = Res2: Resistor; dobavljač: Farnell; kataloški broj: 1160148; cijena (funte): 0.48; opis komponente: Resistor 1.33K 0.1%; Value: 1.33K
R72 = Res2: Resistor; dobavljač: Farnell; kataloški broj: 1858213; cijena (funte): 1.08; opis komponente: Resistor 1K 0.1%; Value: 1K
R75 = Res2: Resistor; dobavljač: Farnell; kataloški broj: 1501725; cijena (funte): 0.60; opis komponente: Resistor 14K 0.1%; Value: 14K
R76 = Res2: Resistor; dobavljač: Farnell; kataloški broj: 1858216; cijena (funte): 0.929; opis komponente: Resistor 2K 0.1%; Value: 2K
R77 = Res2: Resistor; dobavljač: Farnell; kataloški broj: 1858216; cijena (funte): 0.929; opis komponente: Resistor 2K; Value: 2K
R79 = Res2: Resistor; cijena (funte): 0.27; dobavljač: Farnell; kataloški broj: 9369856; opis komponente: Resistor 11.5K 0.1%; Value: 11.5K
R80 = Res2: Resistor; cijena (funte): 1.08; dobavljač: Farnell; kataloški broj: 1858213; opis komponente: Resistor 1K  0.1%; Value: 1K
RFF = Res2: Resistor; cijena (funte): 0.023; dobavljač: Farnell; kataloški broj: 2079009; opis komponente: Resistor 15K; Value: 15K
V7 = Diode 1N4148: High Conductance Fast Diode; cijena (funte): 0.23; dobavljač: Farnell; kataloški broj: 2306401; opis komponente: Dioda (3A, 40V)
V11 = Diode 1N4148: High Conductance Fast Diode; cijena (funte): 0.237; dobavljač: Farnell; kataloški broj: 1773531; opis komponente: dioda
W6 W7 = Jumper: as W10 on sheet CPU_PCB; opis komponente: jumper

## Nets that join several sheets
1.65V: SuperBC (K7.6), Integirane_komponente (12 pins)
3.3V: CPU_PCB (18 pins), Integirane_komponente (16 pins)
9.9V: SuperBC (K6.6), Integirane_komponente (C29.1 R75.2 TP5.1)
12.5V: SuperBC (16 pins), Integirane_komponente (7 pins)
A-: CPU_PCB (22 pins), SuperBC (17 pins), Integirane_komponente (46 pins)
B-: SuperBC (23 pins), Integirane_komponente (C8.2 C17.2 D2.6 D3.3)
BAT+: SuperBC (6 pins), Integirane_komponente (13 pins)
UC4: CPU_PCB (D1.11), SuperBC (7 pins)
A+: SuperBC (R8.2 V2.2), Integirane_komponente (C10.2 D2.3)
B+: SuperBC (R16.2 V6.2), Integirane_komponente (C9.2 D2.5)
C-: SuperBC (R42.1), Integirane_komponente (C16.2 D3.2)
ENA: CPU_PCB (D1.43), SuperBC (D8.1)
ENB: CPU_PCB (D1.44), SuperBC (D8.8)
PWM1A: CPU_PCB (D1.41), SuperBC (D8.2)
PWM1B: CPU_PCB (D1.34), SuperBC (D8.4)
PWM2: CPU_PCB (D1.37), SuperBC (K7.7 TP11.1)
U_bat_temp: CPU_PCB (D1.22), Integirane_komponente (D7A.2)
U_ok_temp: CPU_PCB (D1.23), Integirane_komponente (D7B.2)
Ubat: CPU_PCB (D1.15), SuperBC (C23.2 R1.1 R2.2)
UC1: CPU_PCB (D1.8), SuperBC (C1.2 R12.2 R32.1)
UC2: CPU_PCB (D1.9), SuperBC (C2.2 R37.1 R38.2)
UC3: CPU_PCB (D1.10), SuperBC (C3.2 R39.1 R40.2)
Uout: CPU_PCB (D1.14), Integirane_komponente (D3.6 R17.1 W6.1)
UR8: CPU_PCB (D1.16), Integirane_komponente (D2.13 R20.1)
UR16: CPU_PCB (D1.17), Integirane_komponente (D2.9 R22.1)